# EAGLE design untitled (EAGLE 6.5.0)
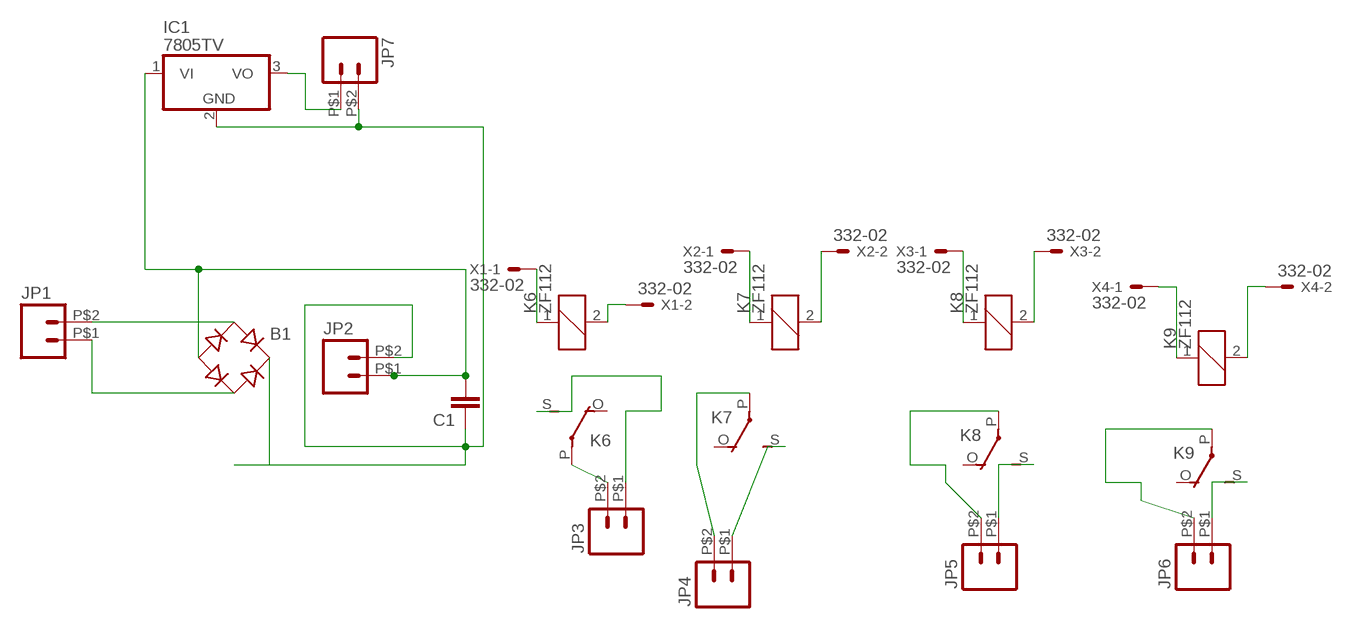
[diagram p0: schematic, sheet 1]

## Parts
B1  RB1A  [RB1A]
C1  CAPKIT  [CAP-PTH-SMALL-KIT]
IC1  7805TV  [TO220V]
JP1  M02PTH2  [1X02_BIG]
JP2  M02PTH2  [1X02_BIG]
JP3  M02PTH2  [1X02_BIG]
JP4  M02PTH2  [1X02_BIG]
JP5  M02PTH2  [1X02_BIG]
JP6  M02PTH2  [1X02_BIG]
JP7  M02PTH2  [1X02_BIG]
K6  ZF112  [ZF112]
K7  ZF112  [ZF112]
K8  ZF112  [ZF112]
K9  ZF112  [ZF112]
X1  332-02  [332-02]
X2  332-02  [332-02]
X3  332-02  [332-02]
X4  332-02  [332-02]

## Nets
N$1: B1.AC1 JP1.P$2
N$2: B1.- C1.2 IC1.1(VI) JP2.P$1
N$3: B1.+ C1.1 IC1.2(GND) JP2.P$2 JP7.P$2
N$4: B1.AC2 JP1.P$1
N$5: K6.1 X1.1
N$6: IC1.3(VO) JP7.P$1
N$7: K6.2 X1.2
N$8: K7.1 X2.1
N$9: K7.2 X2.2
N$10: K8.1 X3.1
N$11: K8.2 X3.2
N$12: K9.1 X4.1
N$13: K9.2 X4.2
N$14: JP3.P$2 K6.P(2:P)
N$15: JP3.P$1 K6.S(2:S)
N$16: JP4.P$2 K7.P(2:P)
N$17: JP4.P$1 K7.S(2:S)
N$18: JP5.P$2 K8.P(2:P)
N$19: JP5.P$1 K8.S(2:S)
N$20: JP6.P$2 K9.P(2:P)
N$21: JP6.P$1 K9.S(2:S)
Unconnected: K6.O(2:O) K7.O(2:O) K8.O(2:O) K9.O(2:O)

## Library data of the parts
B1 = rectifier:RB1A: RECTIFIER 1 A
C1 = SparkFun-Passives:CAP: Capacitor Standard 0603 ceramic capacitor, and 0.1" leaded capacitor.
IC1 = linear:78*: Positive VOLTAGE REGULATOR Source: http://cache.national.com/ds/LM/LM78L05.pdf http://www.fairchildsemi.com/ds/LM/LM7805.pdf
JP1-JP7 = SparkFun-Connectors:M02: Standard 2-pin 0.1" header. Use with - straight break away headers ( PRT-00116) - right angle break away headers (PRT-00553) - swiss pins (PRT-00743) - machine pins (PRT-00117) - female headers (PRT-00115) Molex polarized connector foot print use with: PRT-08233 with associated crimp pins and housings. 2.54_SCREWTERM for use with PRT-10571. 3.5mm Screw Terminal footprints for PRT-08084 5mm Screw Terminal footprints for use with PRT-08432
K6-K9 = relay:ZF112: RELAY 1 x switch; OC_FARNELL: unknown; OC_NEWARK: unknown
X1-X4 = con-garry:332-02: 2 Pin - 2mm Dual Row Source: www.mpe-connector.de / garry_shortform_2012.pdf

## Board
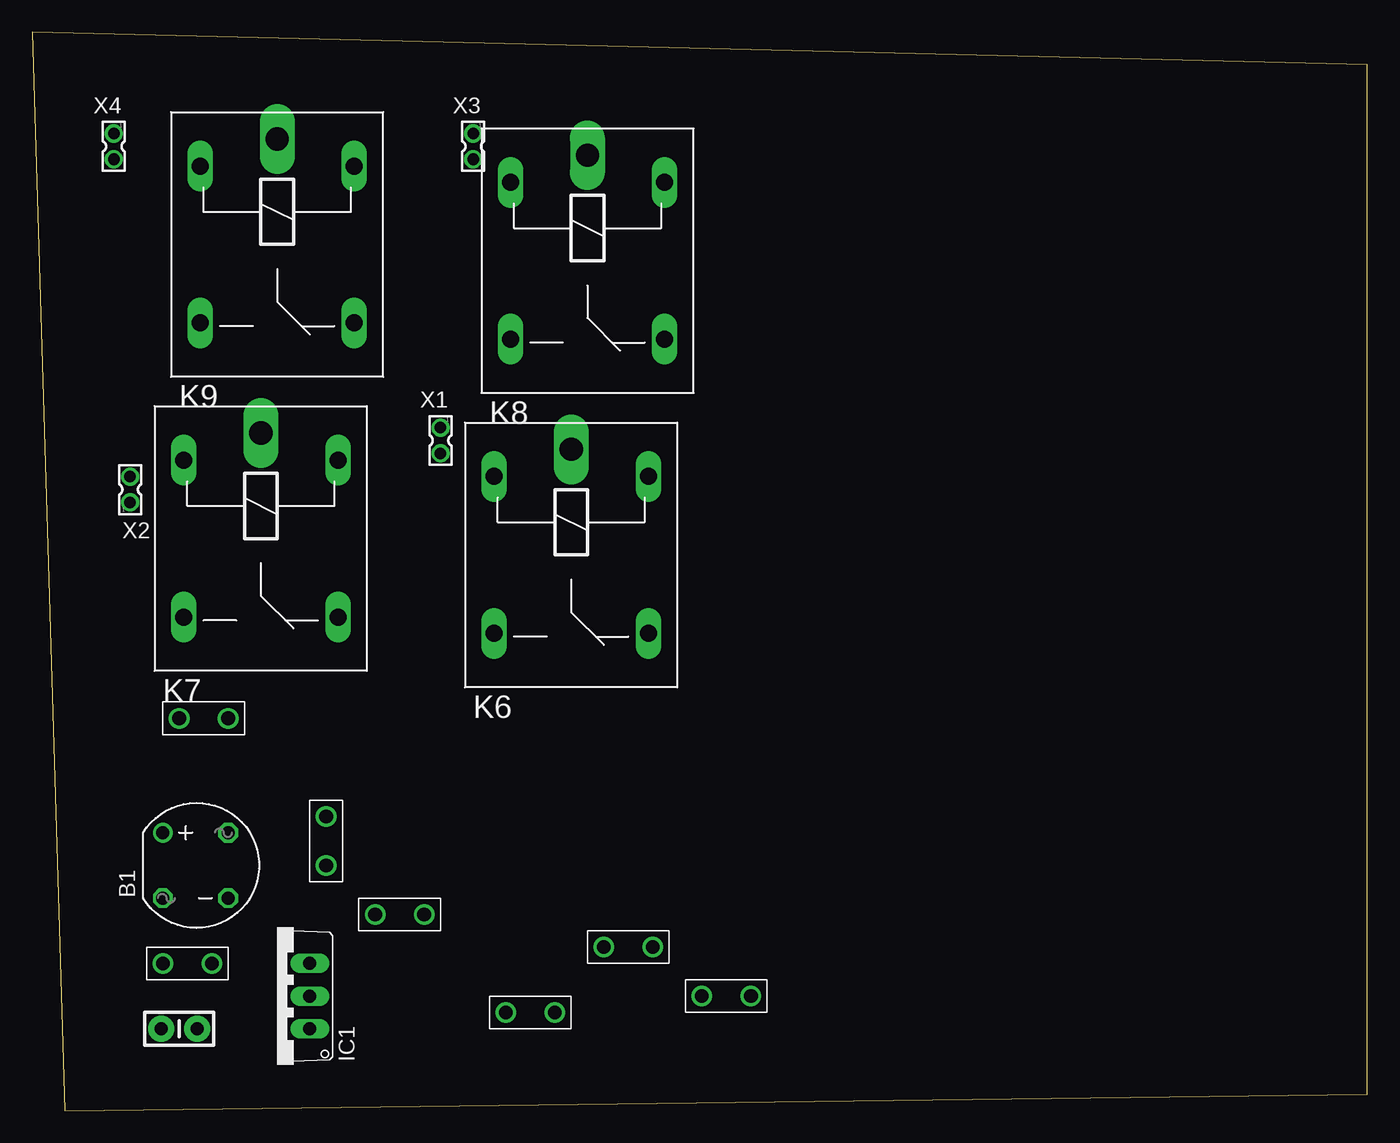
[diagram p1: board, top side]
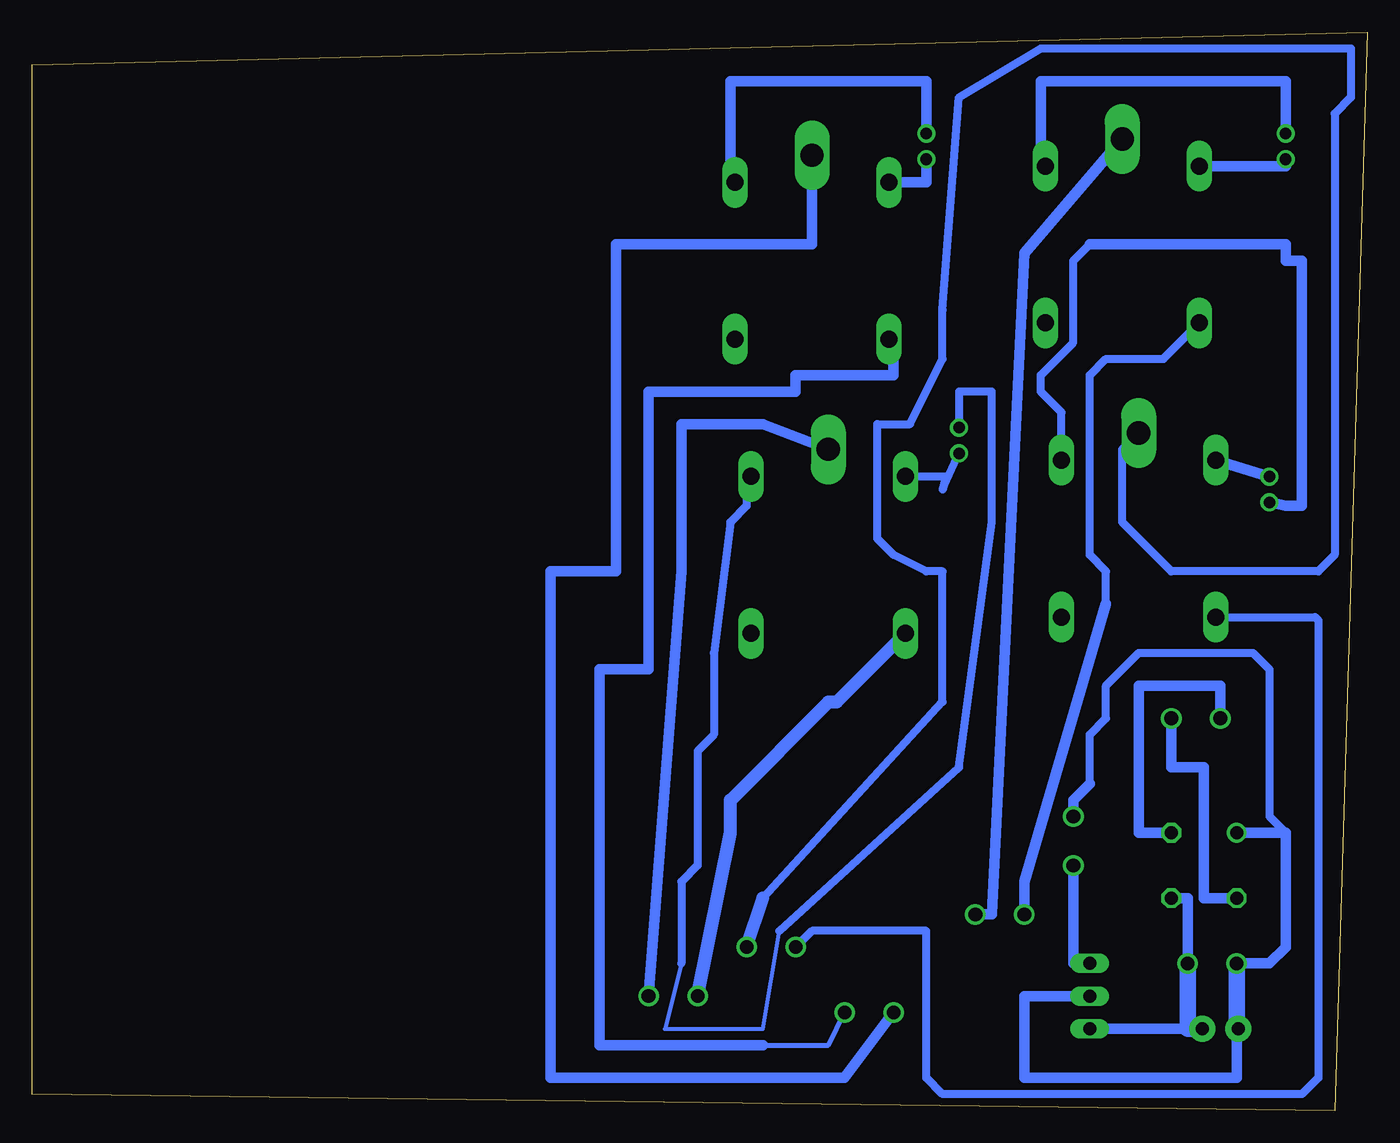
[diagram p2: board, bottom side, seen from below]

Size 103.81 x 83.81 mm. Coordinates in mm from the lower left corner, seen from the top.
Outline: 2.54,0 103.81,1.27 103.81,81.27 0,83.81 2.54,0
Copper layers (1*16): Top 0.035mm / dielectric 1.5mm / Bottom 0.035mm
Design rules "default": minimum track width 10mil, minimum drill 24mil, track to track 8mil, track to pad 8mil, pad to pad 8mil, via to via 8mil, smd to smd 8mil, copper to edge 40mil, drill to drill 8mil, minimum pad ring 10mil, minimum via ring 8mil, stop-mask expansion 4mil, vias tented up to drill 0mil, thermal gap 10mil

### Footprints (pad centres in the part's own frame; a part is rotated, then mirrored left to right if it is on the bottom)
RB1A = drill 1.016: + -2.54,2.54 | drill 1.016 octagon: - 2.54,-2.54; AC1 2.54,2.54; AC2 -2.54,-2.54
CAP-PTH-SMALL-KIT = drill 1.016 pad 2.032: 1 -1.397,0; 2 1.397,0
TO220V = drill 1.016 long: 1 -2.54,-2.54; 2 0,-2.54; 3 2.54,-2.54
1X02_BIG = drill 1.067: P$1 0,0; P$2 3.81,0
ZF112 = drill 1.321 long: 1 -6.096,5.994; 2 -6.096,-5.994; O 6.096,5.994; S 6.096,-5.994 | drill 1.803 long: P -8.204,0
332-02 = drill 0.9 pad 1.27: 1 0,-1; 2 0,1

### Placement (x,y rotation side)
B1  12.7,19.05 0 top
C1  11.43,6.35 0 top
IC1  19.05,8.89 90 top
JP1  15.24,30.48 180 top
JP2  13.97,11.43 180 top
JP3  52.07,8.89 0 top
JP4  44.45,12.7 0 top
JP5  40.64,7.62 180 top
JP6  26.67,15.24 0 top
JP7  22.86,19.05 90 top
K6  41.91,43.18 270 top
K7  17.78,44.45 270 top
K8  43.18,66.04 270 top
K9  19.05,67.31 270 top
X1  31.75,52.07 180 top
X2  7.62,48.26 0 top
X3  34.29,74.93 180 top
X4  6.35,74.93 180 top

### Tracks (layer width: path | path; a pad name or v marks a point on that pad's centre or on a via)
N$1
  Bottom 0.813: B1.AC1 17.78,21.59 17.78,33.02 11.43,33.02 JP1.P$2
N$2
  Bottom 0.813: B1.- 13.97,16.51 JP2.P$1 | C1.2 IC1.1
  Bottom 1.27: C1.2 13.97,6.35 JP2.P$1
N$3
  Bottom 0.61: 21.59,25.4 21.59,29.21 20.32,30.48 20.32,33.02 17.78,35.56 8.89,35.56 7.62,34.29 7.62,22.86 6.35,21.59
  Bottom 0.813: 10.16,6.35 10.16,2.54 26.67,2.54 26.67,8.89 IC1.2 | B1.+ 6.35,21.59 6.35,12.7 7.62,11.43 JP2.P$2 | JP7.P$2 22.86,24.13 21.59,25.4
  Bottom 1.27: C1.1 10.16,6.35 JP2.P$2
N$4
  Bottom 0.813: B1.AC2 12.7,16.51 12.7,26.67 15.24,26.67 JP1.P$1
N$5
  Bottom 0.305: 53.34,11.43 54.61,6.35 46.99,6.35 45.72,13.97
  Bottom 0.61: K6.1 48.01,49.28 48.26,49.53 | 48.26,49.53 48.26,50.8 | 48.26,49.53 48.26,46.99 49.53,45.72 50.8,35.56 50.8,29.21 52.07,27.94 52.07,19.05 53.34,17.78 53.34,11.43 | 45.72,13.97 31.75,26.67 29.21,45.72 29.21,55.88 31.75,55.88 X1.1
N$6
  Bottom 0.813: IC1.3 22.86,11.43 JP7.P$1
N$7
  Bottom 0.61: K6.2 32.77,49.28 33.02,48.26 X1.2
N$8
  Bottom 0.61: K7.1 23.77,54.25 25.4,55.88 25.4,57.15 22.86,59.69 22.86,66.04 21.59,67.31
  Bottom 0.813: 21.59,67.31 6.35,67.31 6.35,66.04 5.08,66.04 5.08,46.99 6.35,46.99 X2.1
N$9
  Bottom 0.813: K7.2 X2.2
N$10
  Bottom 0.813: K8.1 49.53,72.14 49.53,80.01 34.29,80.01 X3.1
N$11
  Bottom 0.813: K8.2 34.29,72.14 X3.2
N$12
  Bottom 0.813: K9.1 25.4,73.41 25.4,80.01 6.35,80.01 X4.1
N$13
  Bottom 0.813: K9.2 6.35,73.41 X4.2
N$14
  Bottom 0.813: K6.P 46.99,53.34 53.34,53.34 53.34,41.91 JP3.P$2
N$15
  Bottom 1.016: JP3.P$1 49.53,21.59 49.53,24.13 41.91,31.75 41.25,31.75 K6.S
N$16
  Bottom 0.61: 46.99,16.51 33.02,31.75 33.02,41.91 34.29,41.91 36.83,43.18 38.1,44.45 38.1,53.34 35.56,53.34 33.02,58.42 33.02,62.23 31.75,78.74 25.4,82.55 1.27,82.55 1.27,78.74 2.54,77.47 2.54,43.18 3.81,41.91 15.24,41.91 19.05,45.72 19.05,51.38 K7.P
  Bottom 1.016: JP4.P$2 46.99,16.51
N$17
  Bottom 0.61: K7.S 4.06,38.35 3.81,38.1 3.81,2.54 5.08,1.27 33.02,1.27 34.29,2.54 34.29,13.97 43.18,13.97 JP4.P$1
N$18
  Bottom 0.813: K8.P 43.18,67.31 58.42,67.31 58.42,41.91 63.5,41.91 63.5,2.54 40.64,2.54 JP5.P$2
N$19
  Bottom 0.406: 46.99,5.08 41.91,5.08 JP5.P$1
  Bottom 0.813: K8.S 36.83,59.94 36.83,57.15 44.45,57.15 44.45,55.88 55.88,55.88 55.88,34.29 59.69,34.29 59.69,5.08 46.99,5.08
N$20
  Bottom 0.813: JP6.P$2 29.21,15.24 26.67,66.62 K9.P
N$21
  Bottom 0.61: 20.32,39.37 20.32,41.91 21.59,43.18 21.59,57.15 20.32,58.42 15.85,58.42 K9.S
  Bottom 0.813: JP6.P$1 26.67,17.78 20.32,39.37